# EAGLE design nRF53_MCU (EAGLE 9.6.2)
Contributed by Nordic Semiconductor Product Page here <http://infocenter.nordicsemi.com/index.jsp?topic=%2Fcom.nordic.infocenter.nrf52832.ps.v1.1%2Fref_circuitry.html> Disclaimer: For the most up to date reference layout see the infocenter at nordicsemi.com Description: Bluetooth Low Energy board

## Sheet 1 of 2
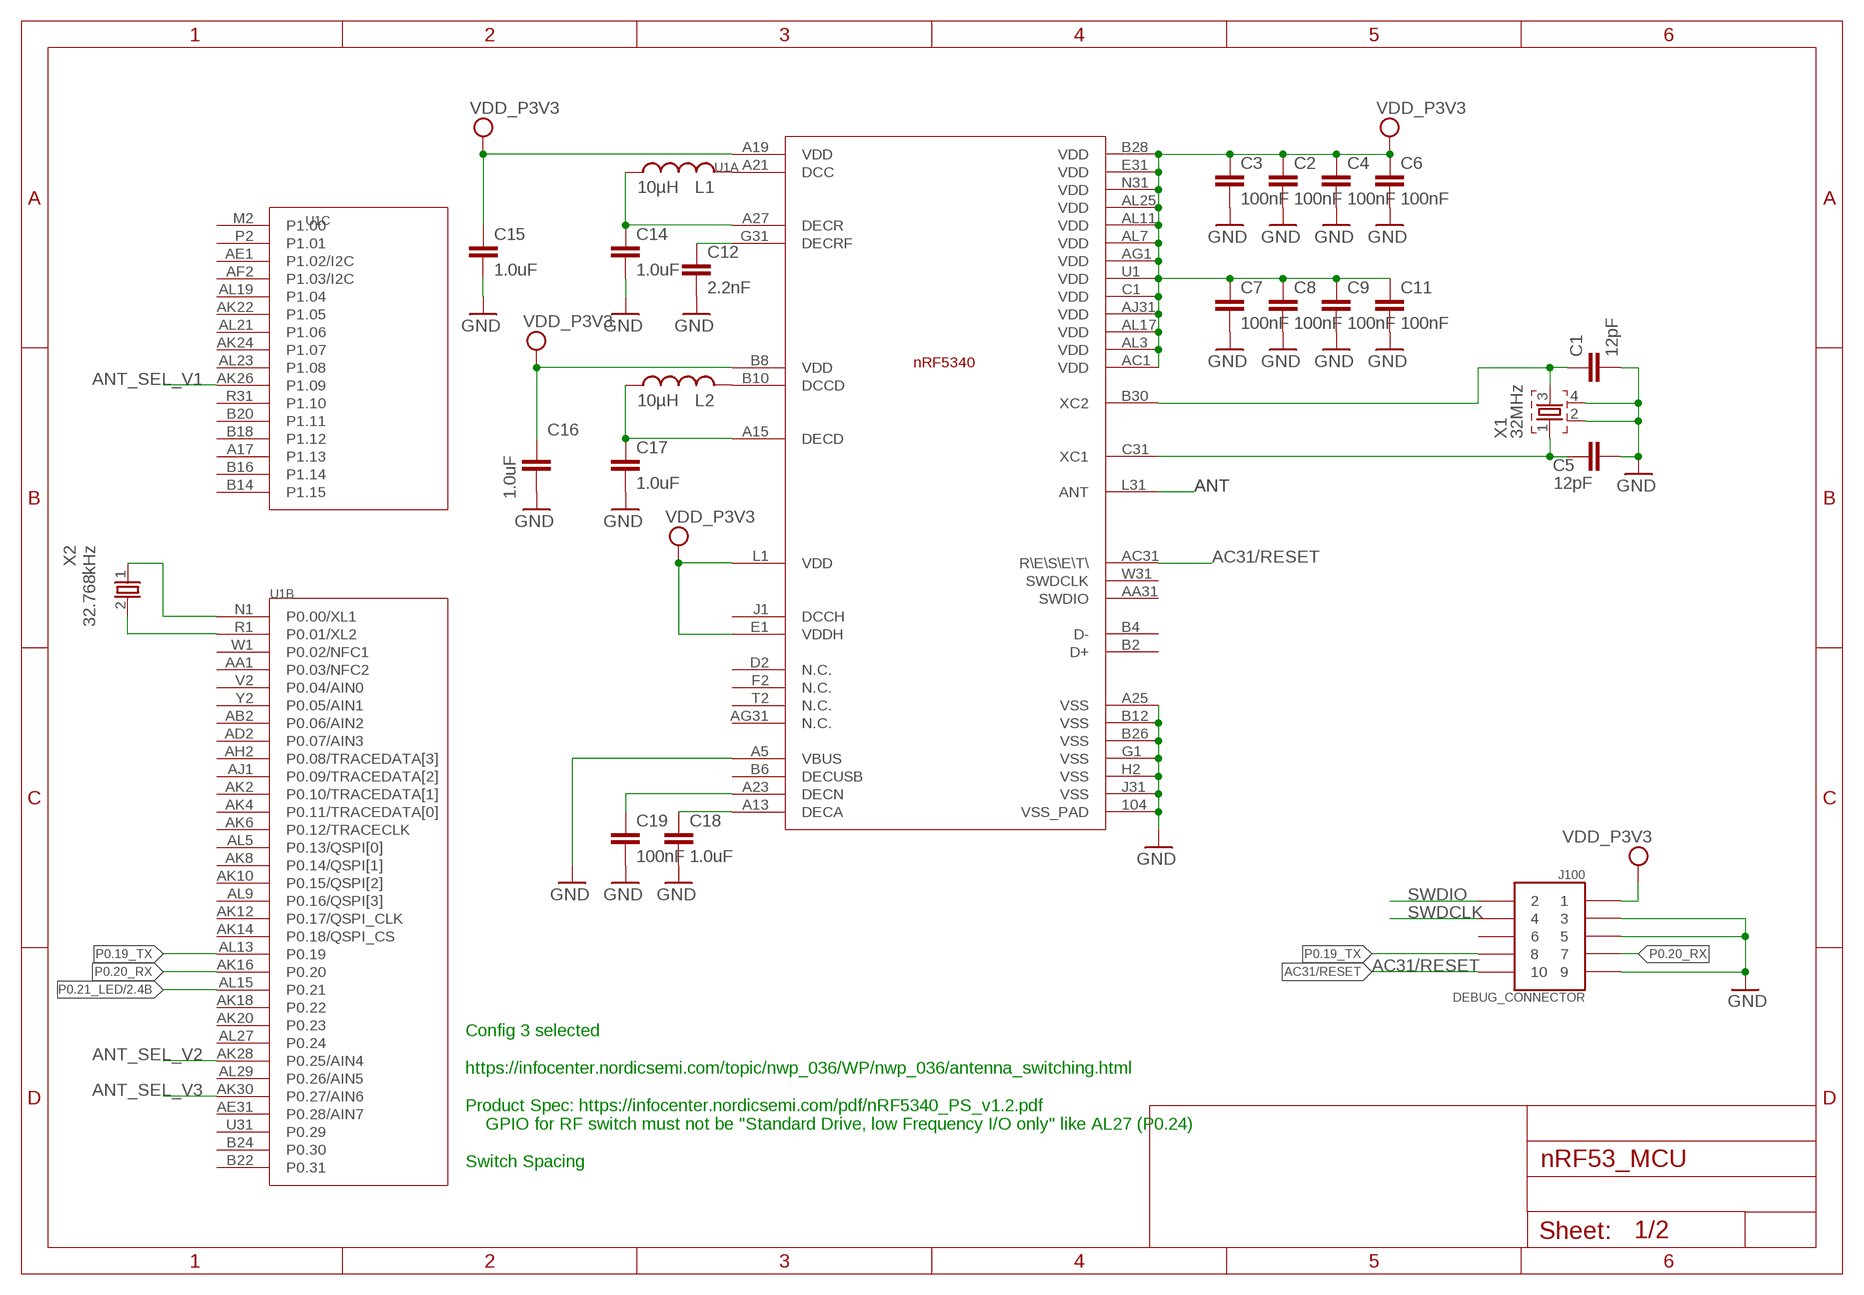
[diagram p0: schematic, sheet 1]

### Parts
C1  12pF  CAPACITOR_0402_N  [RESC0402_N]
C2  100nF  CAPACITOR_0402_N  [RESC0402_N]
C3  100nF  CAPACITOR_0402_N  [RESC0402_N]
C4  100nF  CAPACITOR_0402_N  [RESC0402_N]
C5  12pF  CAPACITOR_0402_N  [RESC0402_N]
C6  100nF  CAPACITOR_0402_N  [RESC0402_N]
C7  100nF  CAPACITOR_0402_N  [RESC0402_N]
C8  100nF  CAPACITOR_0402_N  [RESC0402_N]
C9  100nF  CAPACITOR_0402_N  [RESC0402_N]
C11  100nF  CAPACITOR_0402_N  [RESC0402_N]
C12  2.2nF  CAPACITOR_0402_N  [RESC0402_N]
C14  1.0uF  CAPACITOR_0402_N  [RESC0402_N]
C15  1.0uF  CAPACITOR_0402_N  [RESC0402_N]
C16  1.0uF  CAPACITOR_0402_N  [RESC0402_N]
C17  1.0uF  CAPACITOR_0402_N  [RESC0402_N]
C18  1.0uF  CAPACITOR_0402_N  [RESC0402_N]
C19  100nF  CAPACITOR_0402_N  [RESC0402_N]
J100  DEBUG_CONNECTOR  [HDRV127P5X2-10_N]
L1  10µH  INDUCTOR_0603_N  [RESC0603_N]
L2  10µH  INDUCTOR_0603_N  [RESC0603_N]
U1  nRF5340-QKAA  NRF5340-QKAANRF5340-QKAA_AQFN40P700X700X85_HS-99N  [AQFN40P700X700X85_HS-99N]
X1  32MHz  XTAL_32MHZ  [BT-XTAL_2016_N]
X2  32.768kHz  XTAL_32KHZ  [XTAL_3215_N]

### Nets
AC31/RESET: J100.10 U1.AC31(A:R\E\S\E\T\)
ANT: U1.L31(A:ANT) ; also sheet 2
ANT_SEL_V1: U1.AK26(C:P1.09) ; also sheet 2
ANT_SEL_V2: U1.AK28(B:P0.25/AIN4) ; also sheet 2
ANT_SEL_V3: U1.AK30(B:P0.27/AIN6) ; also sheet 2
GND: C1.2 C2.2 C3.2 C4.2 C5.2 C6.2 C7.2 C8.2 C9.2 C11.2 C12.2 C14.2 C15.2 C16.2 C17.2 C18.2 C19.2 J100.3 J100.5 J100.9 U1.104(A:VSS_PAD) U1.A5(A:VBUS) U1.A25(A:VSS) U1.B12(A:VSS) U1.B26(A:VSS) U1.G1(A:VSS) U1.H2(A:VSS) U1.J31(A:VSS) X1.2 X1.4 ; also sheet 2
N$2: L2.2 U1.B10(A:DCCD)
N$3: C1.1 U1.B30(A:XC2) X1.3
N$4: C14.1 L1.1 U1.A27(A:DECR)
N$19: L1.2 U1.A21(A:DCC)
N$21: C18.1 U1.A13(A:DECA)
N$30: C17.1 L2.1 U1.A15(A:DECD)
N$34: C12.1 U1.G31(A:DECRF)
N$36: C19.1 U1.A23(A:DECN)
N$37: C5.1 U1.C31(A:XC1) X1.1
N$38: U1.N1(B:P0.00/XL1) X2.1
N$39: U1.R1(B:P0.01/XL2) X2.2
P0.19_TX: J100.8 U1.AL13(B:P0.19)
P0.20_RX: J100.7 U1.AK16(B:P0.20)
P0.21_LED: U1.AL15(B:P0.21) ; also sheet 2
SWDCLK: J100.4
SWDIO: J100.2
VCC: C2.1 C3.1 C4.1 C6.1 C7.1 C8.1 C9.1 C11.1 C15.1 C16.1 U1.A19(A:VDD) U1.AC1(A:VDD) U1.AG1(A:VDD) U1.AJ31(A:VDD) U1.AL3(A:VDD) U1.AL7(A:VDD) U1.AL11(A:VDD) U1.AL17(A:VDD) U1.AL25(A:VDD) U1.B8(A:VDD) U1.B28(A:VDD) U1.C1(A:VDD) U1.E1(A:VDDH) U1.E31(A:VDD) U1.L1(A:VDD) U1.N31(A:VDD) U1.U1(A:VDD) ; supply symbol labelled VDD_P3V3
VDD_P3V3: J100.1 ; also sheet 2
Unconnected: J100.6 U1.A17(C:P1.13) U1.AA1(B:P0.03/NFC2) U1.AA31(A:SWDIO) U1.AB2(B:P0.06/AIN2) U1.AD2(B:P0.07/AIN3) U1.AE1(C:P1.02/I2C) U1.AE31(B:P0.28/AIN7) U1.AF2(C:P1.03/I2C) U1.AG31(A:N.C.) U1.AH2(B:P0.08/TRACEDATA[3]) U1.AJ1(B:P0.09/TRACEDATA[2]) U1.AK2(B:P0.10/TRACEDATA[1]) U1.AK4(B:P0.11/TRACEDATA[0]) U1.AK6(B:P0.12/TRACECLK) U1.AK8(B:P0.14/QSPI[1]) U1.AK10(B:P0.15/QSPI[2]) U1.AK12(B:P0.17/QSPI_CLK) U1.AK14(B:P0.18/QSPI_CS) U1.AK18(B:P0.22) U1.AK20(B:P0.23) U1.AK22(C:P1.05) U1.AK24(C:P1.07) U1.AL5(B:P0.13/QSPI[0]) U1.AL9(B:P0.16/QSPI[3]) U1.AL19(C:P1.04) U1.AL21(C:P1.06) U1.AL23(C:P1.08) U1.AL27(B:P0.24) U1.AL29(B:P0.26/AIN5) U1.B2(A:D+) U1.B4(A:D-) U1.B14(C:P1.15) U1.B16(C:P1.14) U1.B18(C:P1.12) U1.B20(C:P1.11) U1.B22(B:P0.31) U1.B24(B:P0.30) U1.D2(A:N.C.) U1.F2(A:N.C.) U1.M2(C:P1.00) U1.P2(C:P1.01) U1.R31(C:P1.10) U1.T2(A:N.C.) U1.U31(B:P0.29) U1.V2(B:P0.04/AIN0) U1.W1(B:P0.02/NFC1) U1.W31(A:SWDCLK) U1.Y2(B:P0.05/AIN1)

### Notes on the sheet
- Config 3 selected
  
  https://infocenter.nordicsemi.com/topic/nwp_036/WP/nwp_036/antenna_switching.html
  
  Product Spec: https://infocenter.nordicsemi.com/pdf/nRF5340_PS_v1.2.pdf
      GPIO for RF switch must not be "Standard Drive, low Frequency I/O only" like AL27 (P0.24)
  
  Switch Spacing

## Sheet 2 of 2
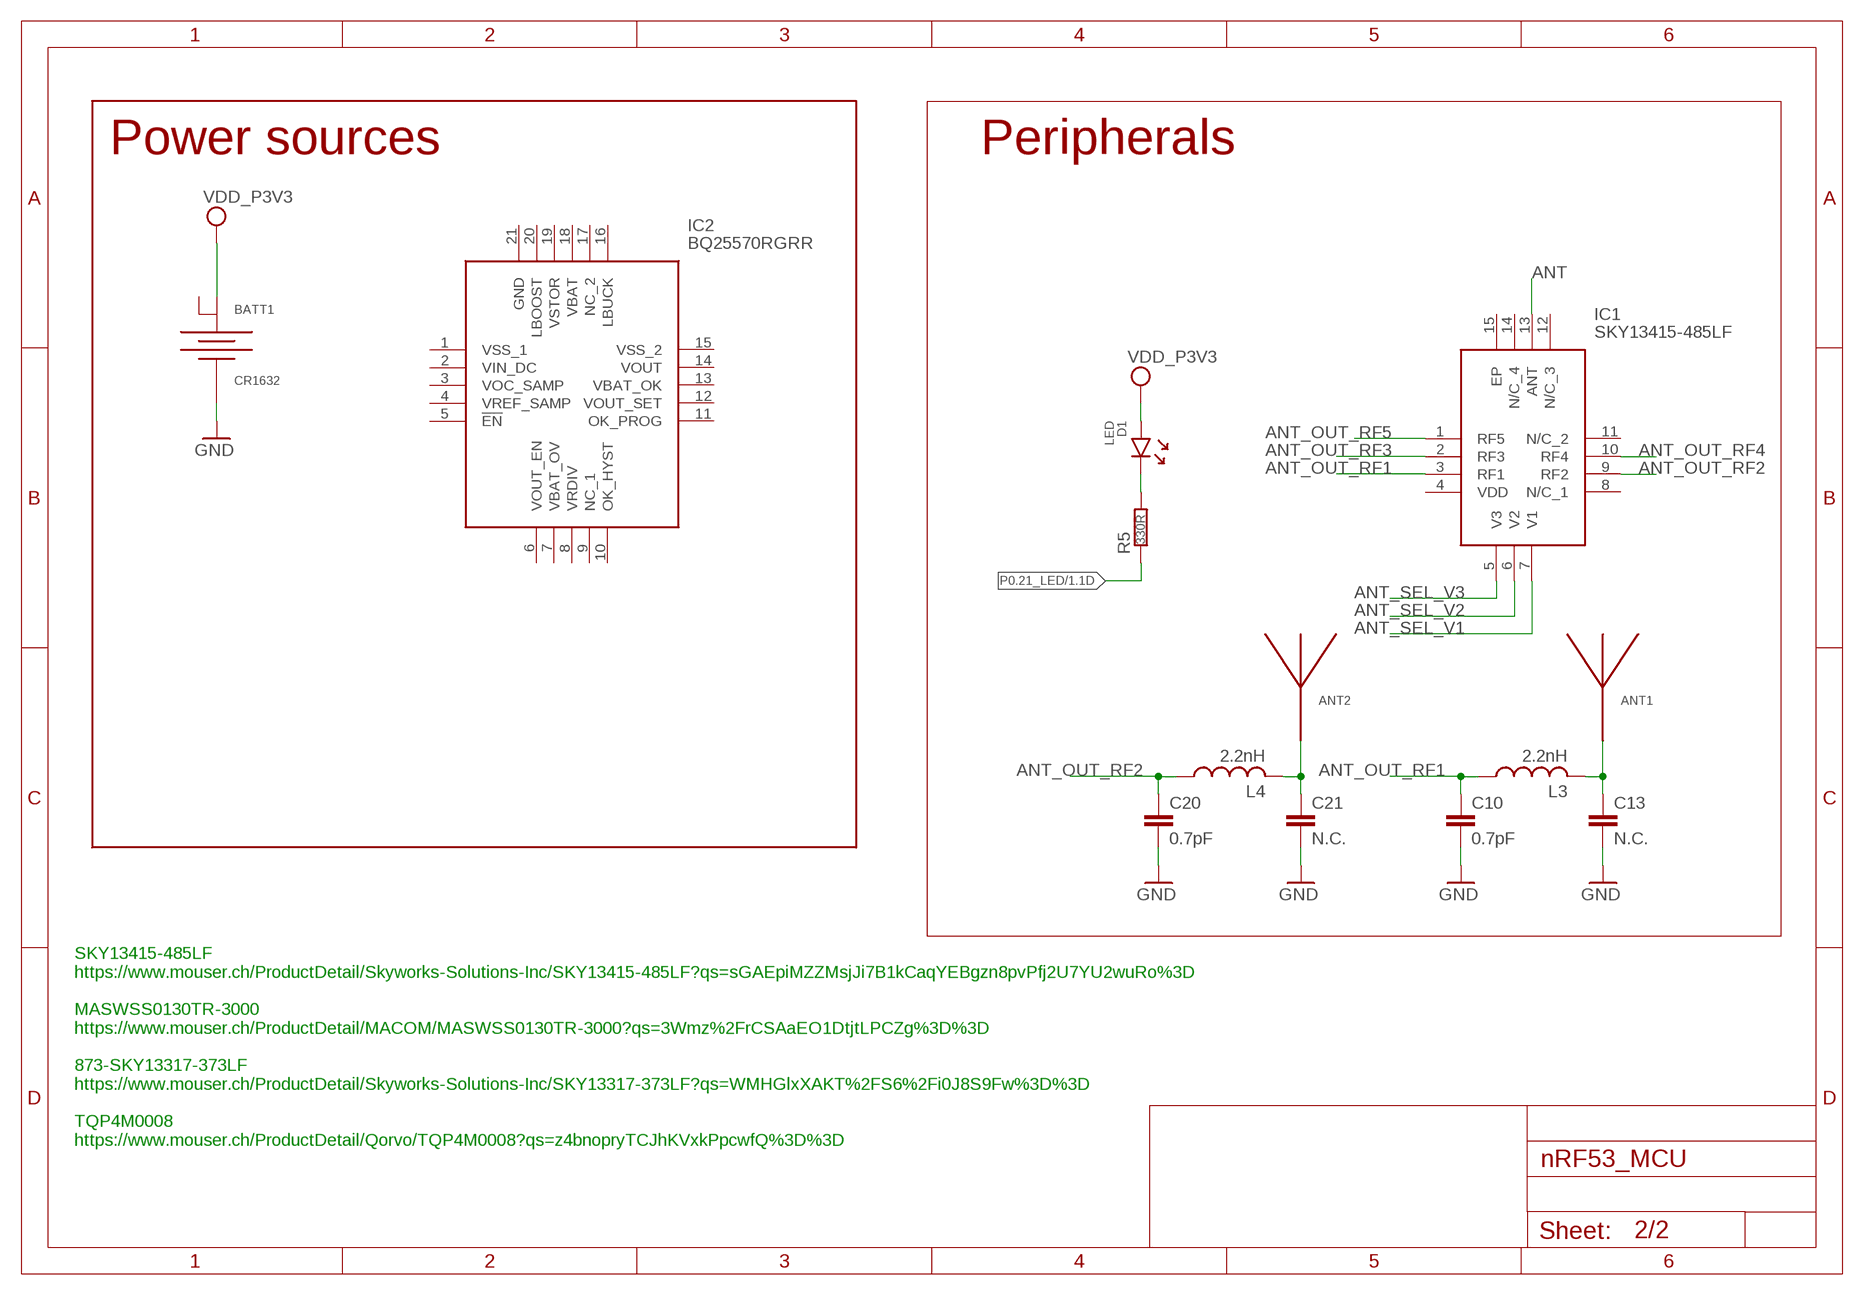
[diagram p1: schematic, sheet 2]

### Parts
ANT1  ANTENNA_QUARTER-WAVE_MONOPOLE_MEANDERED_LEFT  [QWMP_MEANDERED_LEFT_+6]
ANT2  ANTENNA_QUARTER-WAVE_MONOPOLE_MEANDERED_LEFT  [QWMP_MEANDERED_LEFT_+6]
BATT1  CR1632  [CR1632_HOLDER_TH]
C10  0.7pF  CAPACITOR_0402_N  [RESC0402_N]
C13  N.C.  CAPACITOR_0402_N  [RESC0402_N]
C20  0.7pF  CAPACITOR_0402_N  [RESC0402_N]
C21  N.C.  CAPACITOR_0402_N  [RESC0402_N]
D1  LED  [DIOC0603_N]
IC1  SKY13415-485LF  [SKY13415485LF]
IC2  BQ25570RGRR  [QFN50P350X350X100-21N]
L3  2.2nH  INDUCTOR_0402_N  [RESC0402_N]
L4  2.2nH  INDUCTOR_0402_N  [RESC0402_N]
R5  330R  RESISTOR_0402_N  [RESC0402_N]

### Nets
ANT: IC1.13(ANT) ; also sheet 1
ANT_OUT_RF1: C10.1 IC1.3(RF1) L3.1
ANT_OUT_RF2: C20.1 IC1.9(RF2) L4.1
ANT_OUT_RF3: IC1.2(RF3)
ANT_OUT_RF4: IC1.10(RF4)
ANT_OUT_RF5: IC1.1(RF5)
ANT_SEL_V1: IC1.7(V1) ; also sheet 1
ANT_SEL_V2: IC1.6(V2) ; also sheet 1
ANT_SEL_V3: IC1.5(V3) ; also sheet 1
GND: BATT1.1(-) C10.2 C13.2 C20.2 C21.2 ; also sheet 1
N$5: ANT1.P$1 C13.1 L3.2
N$8: D1.1(C) R5.2
N$40: ANT2.P$1 C21.1 L4.2
P0.21_LED: R5.1 ; also sheet 1
VDD_P3V3: BATT1.2(+) D1.2(A) ; also sheet 1
Unconnected: BATT1.3(+2) IC1.4(VDD) IC1.8(N/C_1) IC1.11(N/C_2) IC1.12(N/C_3) IC1.14(N/C_4) IC1.15(EP) IC2.1(VSS_1) IC2.2(VIN_DC) IC2.3(VOC_SAMP) IC2.4(VREF_SAMP) IC2.5(!EN) IC2.6(VOUT_EN) IC2.7(VBAT_OV) IC2.8(VRDIV) IC2.9(NC_1) IC2.10(OK_HYST) IC2.11(OK_PROG) IC2.12(VOUT_SET) IC2.13(VBAT_OK) IC2.14(VOUT) IC2.15(VSS_2) IC2.16(LBUCK) IC2.17(NC_2) IC2.18(VBAT) IC2.19(VSTOR) IC2.20(LBOOST) IC2.21(GND)

### Notes on the sheet
- Power sources | Peripherals
- SKY13415-485LF
  https://www.mouser.ch/ProductDetail/Skyworks-Solutions-Inc/SKY13415-485LF?qs=sGAEpiMZZMsjJi7B1kCaqYEBgzn8pvPfj2U7YU2wuRo%3D
  
  MASWSS0130TR-3000
  https://www.mouser.ch/ProductDetail/MACOM/MASWSS0130TR-3000?qs=3Wmz%2FrCSAaEO1DtjtLPCZg%3D%3D
  
  873-SKY13317-373LF
  https://www.mouser.ch/ProductDetail/Skyworks-Solutions-Inc/SKY13317-373LF?qs=WMHGlxXAKT%2FS6%2Fi0J8S9Fw%3D%3D
  
  TQP4M0008
  https://www.mouser.ch/ProductDetail/Qorvo/TQP4M0008?qs=z4bnopryTCJhKVxkPpcwfQ%3D%3D

## Power pins joined to a net without a drawn wire
DCCH: U1.J1(A:DCCH)
DECUSB: U1.B6(A:DECUSB)

## Library data of the parts
ANT1 ANT2 = Nordic_misc:ANTENNA_QUARTER-WAVE_MONOPOLE_MEANDERED_LEFT
BATT1 = Nordic_misc:CR1632: KEYSTONE 3013 BATTERY THM RETAINER, 16MM Farnell: 1650698
C1-C21 = Nordic_misc:CAPACITOR: Generic chip capacitor
D1 = Nordic_misc:LED
IC1 = SamacSys_Parts:SKY13415-485LF: RF Switch ICs 100-3000MHz SP5T IL .45dB Iso >31dB Source: Datasheet <https://datasheet.datasheetarchive.com/originals/distributors/DKDS-19/379227.pdf>; DESCRIPTION: RF Switch ICs 100-3000MHz SP5T IL .45dB Iso >31dB; HEIGHT: 0.65mm; MANUFACTURER_NAME: Skyworks; MANUFACTURER_PART_NUMBER: SKY13415-485LF; MOUSER_PART_NUMBER: 873-SKY13415-485LF; MOUSER_PRICE-STOCK: https://www.mouser.co.uk/ProductDetail/Skyworks-Solutions-Inc/SKY13415-485LF?qs=aD6bdfC8ElPZ66ZJrc0H4g%3D%3D
IC2 = SamacSys_Parts:BQ25570RGRR: Ultra Low Power Harvester Power Management IC with Boost Charger, and Nanopower Buck Converter Source: Datasheet <http://www.ti.com/lit/gpn/bq25570>; DESCRIPTION: Ultra Low Power Harvester Power Management IC with Boost Charger, and Nanopower Buck Converter; HEIGHT: 1mm; MANUFACTURER_NAME: Texas Instruments; MANUFACTURER_PART_NUMBER: BQ25570RGRR; MOUSER_PART_NUMBER: 595-BQ25570RGRR; MOUSER_PRICE-STOCK: https://www.mouser.co.uk/ProductDetail/Texas-Instruments/BQ25570RGRR?qs=nHyvTUT5UJ%2FNZoBS3n08YQ%3D%3D
J100 = Nordic_misc:DEBUG_CONNECTOR
L1-L4 = Nordic_misc:INDUCTOR: Generic chip inductor
R5 = Nordic_misc:RESISTOR: Generic chip resistor
U1 = nrf5340_qkaa:NRF5340-QKAA: Multi-protocol Bluetooth Low Energy, IEEE 802.15.4, ANT and 2.4GHz proprietary system-on-chip; COMPONENT_CLASS: nRF_Devices; FOOTPRINT_DOC: AQFN-98; PAD_COUNT: 98; PART_NUMBER: nRF5340-QKAA
X1 = Nordic_nRF:XTAL_32MHZ
X2 = Nordic_nRF:XTAL_32KHZ

## Net classes
0 default: clearance 0.205 mm

## Board
Contributed by Nordic Semiconductor Product Page here <http://infocenter.nordicsemi.com/index.jsp?topic=%2Fcom.nordic.infocenter.nrf52832.ps.v1.1%2Fref_circuitry.html> Disclaimer: For the most up to date reference layout see the infocenter at nordicsemi.com Description: Bluetooth Low Energy board
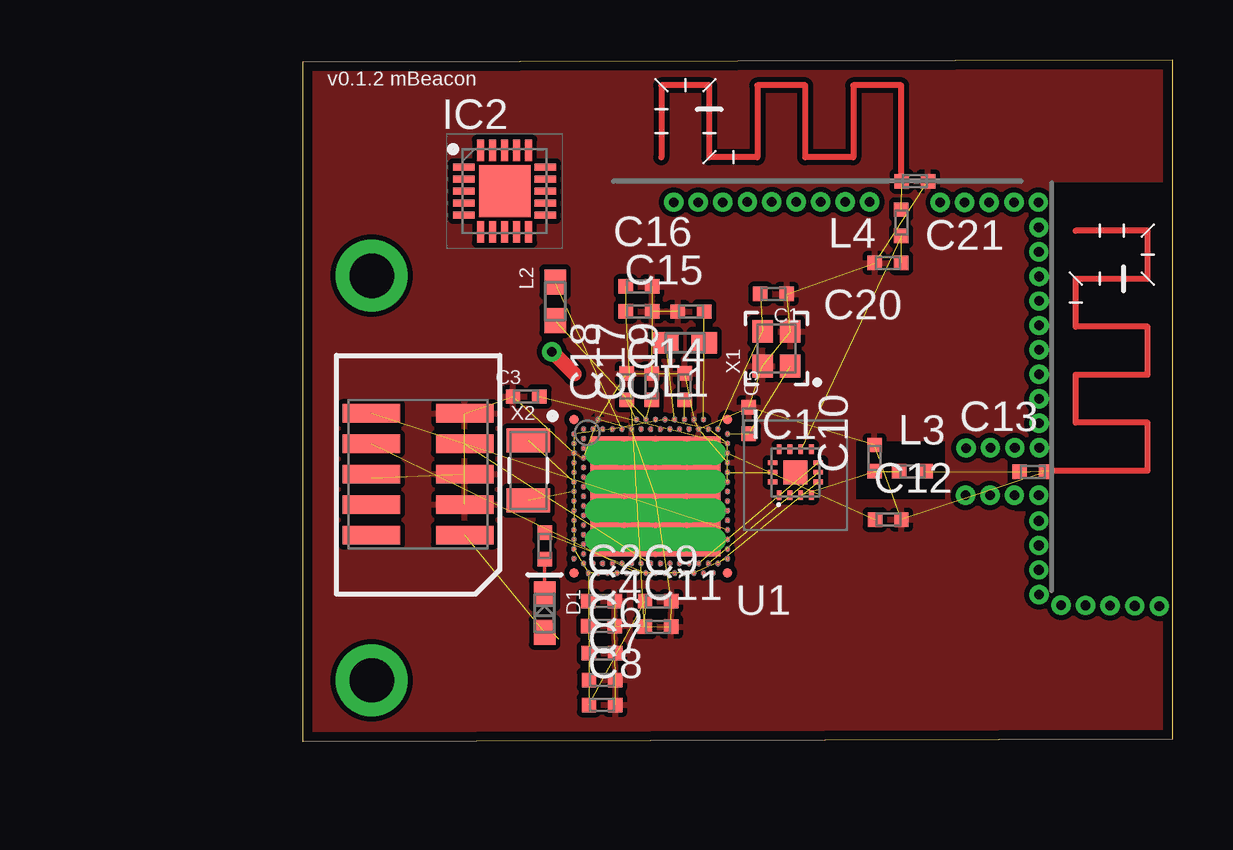
[diagram p2: board, top side]
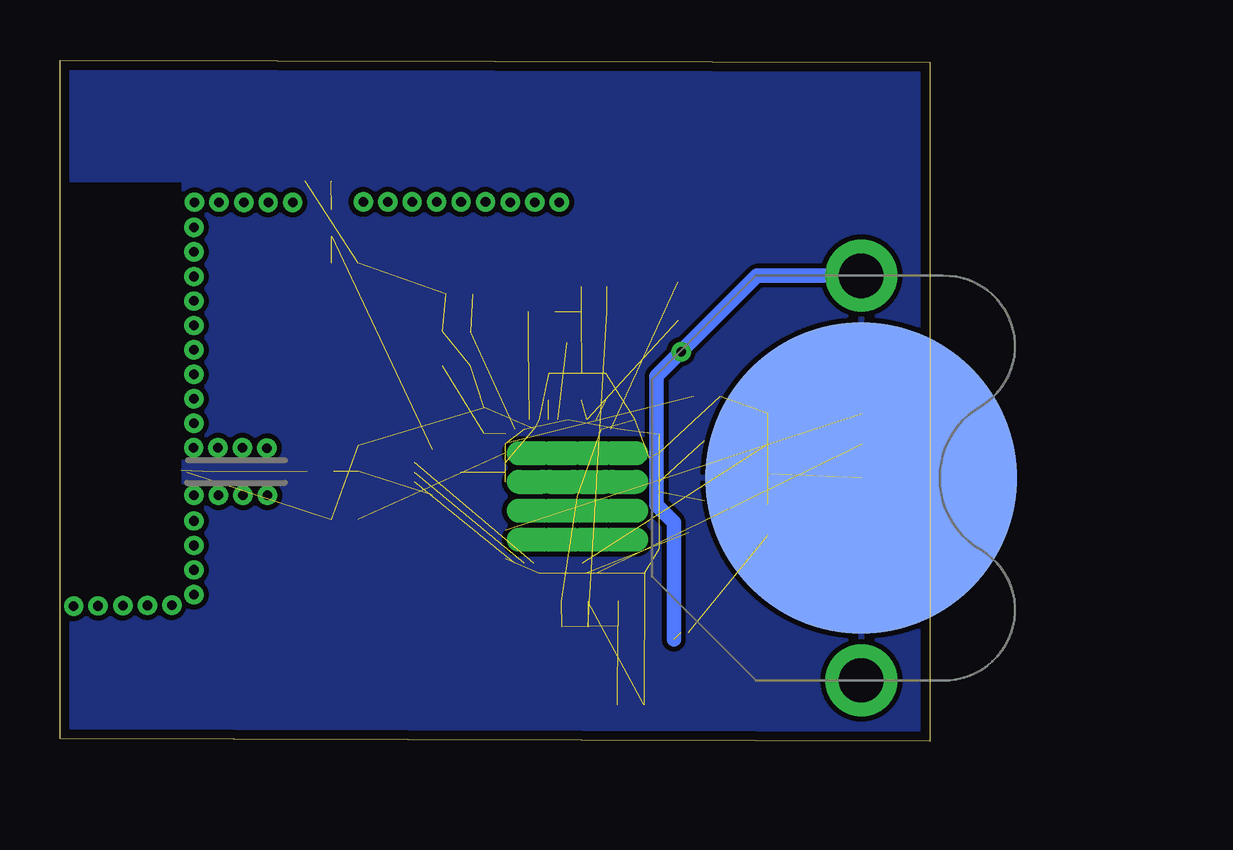
[diagram p3: board, bottom side, seen from below]

Size 36.27 x 28.41 mm. Coordinates in mm from the lower left corner, seen from the top.
Outline: 0,0 36.27,0.1 36.27,28.41 0,28.31 0,0
Copper layers (1*16): Top 0.035mm / dielectric 1.5mm / Bottom 0.035mm
Design rules "nRF52832_MCU *": minimum track width 0.15mm, minimum drill 0.4mm, track to track 0.15mm, track to pad 0.15mm, pad to pad 0.15mm, via to via 0.15mm, smd to smd 0.15mm, copper to edge 0.4mm, drill to drill 0.4mm, minimum pad ring 10mil, minimum via ring 8mil, stop-mask expansion 0.1mm, vias tented up to drill 0.41mm, thermal gap 0.2mm
tRestrict: area 29.7,9.6 to 31.2,12; area 31.2,6.2 to 36.2,23.3; area 23.1,10.1 to 26.8,12.5
bRestrict: area 31.2,6.1 to 36.2,23.3

### Footprints (pad centres in the part's own frame; a part is rotated, then mirrored left to right if it is on the bottom)
QWMP_MEANDERED_LEFT_+6 = smd 0.254 x 0.254: P$1 0,0
CR1632_HOLDER_TH = smd 13 x 13: 1 0,0 | drill 1.85 pad 3: 2 -8.435,0; 3 8.435,0
RESC0402_N = smd 0.6 x 0.6: 1 -0.55,0; 2 0.55,0
DIOC0603_N = smd 1.05 x 0.9: 1 -0.8,0; 2 0.8,0
SKY13415485LF = smd 0.395 x 0.2: 1 -0.953,0.675; 2 -0.953,0.225; 3 -0.953,-0.225; 4 -0.953,-0.675; 8 0.953,-0.675; 9 0.953,-0.225; 10 0.953,0.225; 11 0.953,0.675 | smd 0.2 x 0.395: 5 -0.4,-0.953; 6 0,-0.953; 7 0.4,-0.953; 12 0.4,0.953; 13 0,0.953; 14 -0.4,0.953 | smd 1 x 1: 15 0,0
QFN50P350X350X100-21N = smd 0.9 x 0.3: 1 -1.7,1; 2 -1.7,0.5; 3 -1.7,0; 4 -1.7,-0.5; 5 -1.7,-1; 11 1.7,-1; 12 1.7,-0.5; 13 1.7,0; 14 1.7,0.5; 15 1.7,1 | smd 0.3 x 0.9: 6 -1,-1.7; 7 -0.5,-1.7; 8 0,-1.7; 9 0.5,-1.7; 10 1,-1.7; 16 1,1.7; 17 0.5,1.7; 18 0,1.7; 19 -0.5,1.7; 20 -1,1.7 | smd 2.15 x 2.15: 21 0,0
HDRV127P5X2-10_N = smd 0.76 x 2.4: 1 -2.54,-1.95; 2 -2.54,1.95; 3 -1.27,-1.95; 4 -1.27,1.95; 5 0,-1.95; 6 0,1.95; 7 1.27,-1.95; 8 1.27,1.95; 9 2.54,-1.95; 10 2.54,1.95
RESC0603_N = smd 1.05 x 0.9: 1 -0.8,0; 2 0.8,0
AQFN40P700X700X85_HS-99N = smd 5.4 x 5: 104 0.2,0 | drill 0 pad 1 long: _ 2.15,1.8; _-1 0.85,1.8; _-2 -0.45,1.8; _-3 -1.75,1.8; _-4 2.15,0.6; _-5 0.85,0.6; _-6 -0.45,0.6; _-7 -1.75,0.6; _-8 2.15,-0.6; _-9 0.85,-0.6; _-10 -0.45,-0.6; _-11 -1.75,-0.6; _-12 -1.75,-1.8; _-13 -0.45,-1.8; _-14 0.85,-1.8; _-15 2.15,-1.8 | smd 0.4 x 0.4: A1 -3.2,3.2; A31 3.2,3.2; AL1 -3.2,-3.2; AL31 3.2,-3.2 | smd 0.225 x 0.225: A5 -2.2,3.2; A13 -0.6,3.2; A15 -0.2,3.2; A17 0.2,3.2; A19 0.6,3.2; A21 1,3.2; A23 1.4,3.2; A25 1.8,3.2; A27 2.2,3.2; AA1 -3.2,-1; AA31 3.2,-1; AB2 -2.8,-1.2; AC1 -3.2,-1.4; AC31 3.2,-1.4; AD2 -2.8,-1.6; AE1 -3.2,-1.8; AE31 3.2,-1.8; AF2 -2.8,-2; AG1 -3.2,-2.2; AG31 3.2,-2.2; AH2 -2.8,-2.4; AJ1 -3.2,-2.6; AJ31 3.2,-2.6; AK2 -2.8,-2.8; AK4 -2.4,-2.8; AK6 -2,-2.8; AK8 -1.6,-2.8; AK10 -1.2,-2.8; AK12 -0.8,-2.8; AK14 -0.4,-2.8; AK16 0,-2.8; AK18 0.4,-2.8; AK20 0.8,-2.8; AK22 1.2,-2.8; AK24 1.6,-2.8; AK26 2,-2.8; AK28 2.4,-2.8; AK30 2.8,-2.8; AL3 -2.6,-3.2; AL5 -2.2,-3.2; AL7 -1.8,-3.2; AL9 -1.4,-3.2; AL11 -1,-3.2; AL13 -0.6,-3.2; AL15 -0.2,-3.2; AL17 0.2,-3.2; AL19 0.6,-3.2; AL21 1,-3.2; AL23 1.4,-3.2; AL25 1.8,-3.2; AL27 2.2,-3.2; AL29 2.6,-3.2; B2 -2.8,2.8; B4 -2.4,2.8; B6 -2,2.8; B8 -1.6,2.8; B10 -1.2,2.8; B12 -0.8,2.8; B14 -0.4,2.8; B16 0,2.8; B18 0.4,2.8; B20 0.8,2.8; B22 1.2,2.8; B24 1.6,2.8; B26 2,2.8; B28 2.4,2.8; B30 2.8,2.8; C1 -3.2,2.6; C31 3.2,2.6; D2 -2.8,2.4; E1 -3.2,2.2; E31 3.2,2.2; F2 -2.8,2; G1 -3.2,1.8; G31 3.2,1.8; H2 -2.8,1.6; J1 -3.2,1.4; J31 3.2,1.4; K2 -2.8,1.2; L1 -3.2,1; L31 3.2,1; M2 -2.8,0.8; N1 -3.2,0.6; N31 3.2,0.6; P2 -2.8,0.4; R1 -3.2,0.2; R31 3.2,0.2; T2 -2.8,0; U1 -3.2,-0.2; U31 3.2,-0.2; V2 -2.8,-0.4; W1 -3.2,-0.6; W31 3.2,-0.6; Y2 -2.8,-0.8
BT-XTAL_2016_N = smd 0.95 x 0.85: 1 -0.725,-0.575; 2 0.725,-0.575; 3 0.725,0.575; 4 -0.725,0.575
XTAL_3215_N = smd 1 x 1.8: 1 -1.25,0; 2 1.25,0

### Placement (x,y rotation side)
ANT1  31.22,11.29 0 top
ANT2  24.94,23.35 90 top
BATT1  2.87,10.98 270 bottom
C1  19.62,18.66 0 top
C2  12.45,5.85 0 top
C3  9.31,14.38 180 top
C4  12.45,4.81 0 top
C5  18.59,13.38 90 top
C6  12.47,3.68 0 top
C7  12.48,2.56 0 top
C8  12.48,1.52 0 top
C9  14.81,5.84 0 top
C10  23.83,11.81 90 top
C11  14.8,4.78 0 top
C12  24.4,9.25 0 top
C13  30.43,11.24 0 top
C14  16.18,17.92 180 top
C15  14.01,17.93 0 top
C16  14.01,18.97 0 top
C17  14.54,14.79 90 top
C18  13.5,14.79 90 top
C19  15.91,14.79 90 top
C20  24.39,19.95 180 top
C21  25.51,23.35 0 top
D1  10.08,5.35 270 top
IC1  20.53,11.22 90 top
IC2  8.41,22.94 0 top
J100  4.8,11.14 90 top
L1  15.93,16.62 180 top
L2  10.52,18.35 90 top
L3  25.41,11.26 0 top
L4  24.94,21.62 90 top
R5  10.08,8.15 270 top
U1  14.5,10.22 0 top
X1  19.74,16.37 90 top
X2  9.4,11.29 270 top

### Tracks (layer width: path | path; a pad name or v marks a point on that pad's centre or on a via)
AC31/RESET  (1 unrouted)
ANT  (1 unrouted)
ANT_OUT_RF1  (2 unrouted)
ANT_OUT_RF2  (2 unrouted)
ANT_SEL_V1  (1 unrouted)
ANT_SEL_V2  (1 unrouted)
ANT_SEL_V3  (1 unrouted)
GND  (34 unrouted)
  pour Bottom: 0.02,0.1 0.02,28.37 36.27,28.37 36.27,0.1
  pour Top: 0.02,0.1 0.02,28.37 36.27,28.37 36.27,0.1
N$1  (via drill 0.4)
  other vias: 30.69,13.26
N$2  (1 unrouted)
N$3  (2 unrouted)
N$4  (2 unrouted)
N$5  (2 unrouted)
N$6  (via drill 0.4)
  other vias: 30.69,14.28
N$7  (via drill 0.4)
  other vias: 29.66,10.26
N$8
  Top 0.152: R5.2 D1.1
N$9  (via drill 0.4)
  other vias: 27.62,10.26
N$10  (via drill 0.4)
  other vias: 30.66,22.48
N$11  (via drill 0.4)
  other vias: 30.69,15.3
N$12  (via drill 0.4)
  other vias: 30.69,16.32
N$13  (via drill 0.4)
  other vias: 30.69,17.34
N$14  (via drill 0.4)
  other vias: 30.69,18.36
N$15  (via drill 0.4)
  other vias: 30.69,19.38
N$16  (via drill 0.4)
  other vias: 30.68,20.41
N$17  (via drill 0.4)
  other vias: 30.68,21.43
N$19  (1 unrouted)
N$20  (via drill 0.4)
  other vias: 28.64,10.26
N$21  (1 unrouted)
N$22  (via drill 0.4)
  other vias: 30.7,12.24
N$23  (via drill 0.4)
  other vias: 29.64,22.48
N$24  (via drill 0.4)
  other vias: 28.61,22.47
N$25  (via drill 0.4)
  other vias: 27.59,22.47
N$26  (via drill 0.4)
  other vias: 30.69,6.12
N$27  (via drill 0.4)
  other vias: 30.68,7.15
N$28  (via drill 0.4)
  other vias: 30.68,8.17
N$29  (via drill 0.4)
  other vias: 30.68,9.19
N$30  (2 unrouted)
N$31  (via drill 0.4)
  other vias: 27.64,12.23
N$32  (via drill 0.4)
  other vias: 28.66,12.24
N$33  (via drill 0.4)
  other vias: 30.68,10.26
N$34  (1 unrouted)
N$35  (via drill 0.4)
  other vias: 29.68,12.24
N$36  (1 unrouted)
N$37  (2 unrouted)
N$38  (1 unrouted)
N$39  (1 unrouted)
N$40  (2 unrouted)
N$42  (via drill 0.4)
  other vias: 23.63,22.49
N$43  (via drill 0.4)
  other vias: 22.61,22.49
N$44  (via drill 0.4)
  other vias: 21.59,22.49
N$45  (via drill 0.4)
  other vias: 20.57,22.49
N$46  (via drill 0.4)
  other vias: 19.55,22.49
N$47  (via drill 0.4)
  other vias: 18.53,22.49
N$48  (via drill 0.4)
  other vias: 17.5,22.48
N$49  (via drill 0.4)
  other vias: 16.48,22.48
N$50  (via drill 0.4)
  other vias: 15.46,22.48
N$51  (via drill 0.4)
  other vias: 31.61,5.68
N$52  (via drill 0.4)
  other vias: 32.63,5.67
N$53  (via drill 0.4)
  other vias: 33.65,5.66
N$54  (via drill 0.4)
  other vias: 34.68,5.65
N$55  (via drill 0.4)
  other vias: 35.7,5.64
N$56  (via drill 0.4)
  other vias: 26.57,22.47
P0.19_TX  (1 unrouted)
P0.20_RX  (1 unrouted)
P0.21_LED  (1 unrouted)
VCC  (26 unrouted)
VDD_P3V3  (via drill 0.4)  (2 unrouted)
  Top 0.152: 10.38,4.55 D1.2
  Top 0.6: v10.38,16.25 11.32,15.31
  Bottom 0.152: 11.41,9.88 11.41,9.85
  Bottom 0.6: BATT1.2 7.21,19.42 v10.38,16.25 | 11.41,9.88 11.41,15.22 v10.38,16.25 | 10.68,4.25 10.68,9.12 11.41,9.85 | 10.43,16.2 v10.38,16.25

### Text on the board
tNames: v0.1.2 mBeacon